# Altium schematic sheet 10scm153adp1_pwr.SchDoc
size A4; DocumentNumber: 3; SheetNumber: 3; SheetTotal: 3
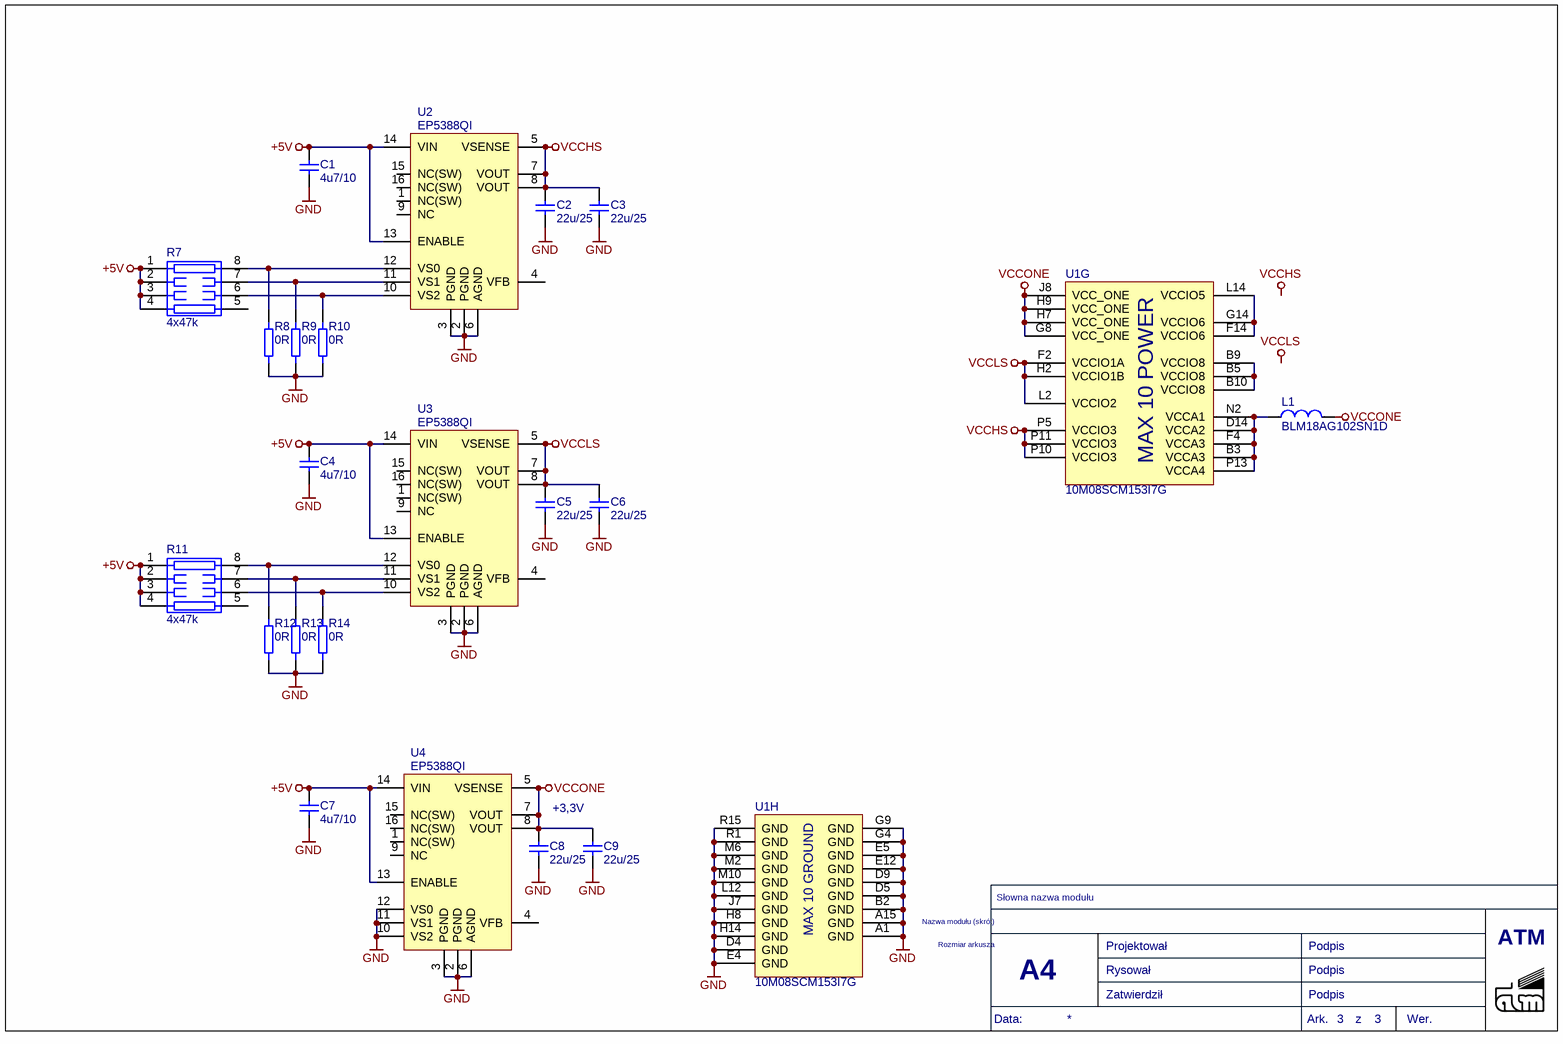
[diagram p0: 10scm153adp1_pwr.SchDoc]

## Parts
C1  4u7/10  [0603-IPC]
C2  22u/25  [0805]
C3  22u/25  [0805]
C4  4u7/10  [0603-IPC]
C5  22u/25  [0805]
C6  22u/25  [0805]
C7  4u7/10  [0603-IPC]
C8  22u/25  [0805]
C9  22u/25  [0805]
L1  BLM18AG102SN1D  [0603-IPC]
R7  4x47k  [1206RP]
R8  0R  [0603R]
R9  0R  [0603R]
R10  0R  [0603R]
R11  4x47k  [1206RP]
R12  0R  [0603R]
R13  0R  [0603R]
R14  0R  [0603R]
U1  10M08SCM153I7G  [MBGA153x15]  (parts G,H of 8)
U2  EP5388QI  [EP5368QI]
U3  EP5388QI  [EP5368QI]
U4  EP5388QI  [EP5368QI]

## Nets
+5V: C1.1 C4.1 C7.1 R7.1(R1) R7.2(R2) R7.3(R3) R7.4(R4) R11.1(R1) R11.2(R2) R11.3(R3) R11.4(R4) U2.13(ENABLE) U2.14(VIN) U3.13(ENABLE) U3.14(VIN) U4.13(ENABLE) U4.14(VIN)
GND: C1.2 C2.2 C3.2 C4.2 C5.2 C6.2 C7.2 C8.2 C9.2 R8.2 R9.2 R10.2 R12.2 R13.2 R14.2 U1.A1(GND) U1.A15(GND) U1.B2(GND) U1.D4(GND) U1.D5(GND) U1.D9(GND) U1.E4(GND) U1.E5(GND) U1.E12(GND) U1.G4(GND) U1.G9(GND) U1.H8(GND) U1.H14(GND) U1.J7(GND) U1.L12(GND) U1.M2(GND) U1.M6(GND) U1.M10(GND) U1.R1(GND) U1.R15(GND) U2.2(PGND) U2.3(PGND) U2.6(AGND) U3.2(PGND) U3.3(PGND) U3.6(AGND) U4.2(PGND) U4.3(PGND) U4.6(AGND) U4.10(VS2) U4.11(VS1) U4.12(VS0)
VCCHS: C2.1 C3.1 U1.P5(VCCIO3) U1.P10(VCCIO3) U1.P11(VCCIO3) U2.5(VSENSE) U2.7(VOUT) U2.8(VOUT)
VCCLS: C5.1 C6.1 U1.F2(VCCIO1A) U1.H2(VCCIO1B) U1.L2(VCCIO2) U3.5(VSENSE) U3.7(VOUT) U3.8(VOUT)
VCCONE: C8.1 C9.1 L1.2 U1.G8(VCC_ONE) U1.H7(VCC_ONE) U1.H9(VCC_ONE) U1.J8(VCC_ONE) U4.5(VSENSE) U4.7(VOUT) U4.8(VOUT)
NetL1_1: L1.1 U1.B3(VCCA3) U1.D14(VCCA2) U1.F4(VCCA3) U1.N2(VCCA1) U1.P13(VCCA4)
NetR7_6: R7.6(R6) R10.1 U2.10(VS2)
NetR7_7: R7.7(R7) R9.1 U2.11(VS1)
NetR7_8: R7.8(R8) R8.1 U2.12(VS0)
NetR11_6: R11.6(R6) R14.1 U3.10(VS2)
NetR11_7: R11.7(R7) R13.1 U3.11(VS1)
NetR11_8: R11.8(R8) R12.1 U3.12(VS0)
NetU1_B5: U1.B5(VCCIO8) U1.B9(VCCIO8) U1.B10(VCCIO8)
NetU1_F14: U1.F14(VCCIO6) U1.G14(VCCIO6) U1.L14(VCCIO5)

Not connected (* = marked no-connect by the designer): R7 5(R5); R11 5(R5); U2 1(NC(SW)) 4(VFB) 9(NC) 15(NC(SW)) 16(NC(SW)); U3 1(NC(SW)) 4(VFB) 9(NC) 15(NC(SW)) 16(NC(SW)); U4 1(NC(SW)) 4(VFB) 9(NC) 15(NC(SW)) 16(NC(SW))

## Notes on the sheet
- +3,3V
- Labels drawn without touching a wire or pin: VCCHS, VCCLS
- Nazwa modułu (skrót)
- Słowna nazwa modułu
- Rozmiar arkusza
- A4
- Zatwierdził
- Projektował
- Rysował
- Podpis
- ATM
- Data:
- Ark.
- z
- Wer.
- (in symbol ICs341, part G) MAX 10 POWER
- (in symbol ICs341, part H) MAX 10 GROUND

## Library data of the parts
C1 C4 C7 = CAP131: Kod: CAP131; ID: 131; Descript: Kondensator: ceramiczny; MLCC; 4,7uF; 10V; X5R; ±10%; SMD; 0603; Reference5: CL10A475KP8NNNC; Value: 4u7/10; Price5: 0; DateOfPrice5: 01-01-2010; Supplier5: tme.pl; Manufacturer5: Samsung; Typ5: CL10A475KP8NNNC
C2 C3 C5 C6 C8 C9 = CAP96: Kod: CAP96; ID: 96; Descript: Kondensator: ceramiczny; MLCC; 22uF; 25V; X5R; ±20%; SMD; 0805; Reference5: CL21A226MAQNNNE; Value: 22u/25; Price5: 1,5; DateOfPrice5: 29-12-2020; Supplier5: tme.pl; Manufacturer5: Samsung; Typ5: CL21A226MAQNNNE
L1 = Ind41: Kod: Ind41; ID: 41; Descript: Ferryt: koralik; Imp.@ 100MHz:1000om; Montaż: SMD; 0,4A; Obud:0603; Value: BLM18AG102SN1D; InductCurr: -; Price5: 0; DateOfPrice5: 10-05-2020; Supplier5: tme.pl; Reference5: BLM18AG102SN1D; Manufacturer5: Murata; Typ5: BLM18AG102SN1D
R7 R11 = Res182: Kod: Res182; ID: 182; Descript: Drabinka rezystorowa: Y; 47kΩ; SMD; 1206; Il.rezystorów:4; 63mW; Reference5: DR1206-47K-4/8; Typ5: 4D03WGJ0473T; Value: 4x47k; Price5: 0,1; DateOfPrice5: 10-05-2020; Supplier5: tme.pl; Manufacturer5: Royal Ohm
R8-R10 R12-R14 = Res1: Kod: Res1; ID: 1; Descript: Rezystor: thick film; SMD; 0603; 0ohm; 0,1W; ±5%; -55÷155°C; Reference5: RC0603JR-070R; Typ5: RC0603JR-070RL; Value: 0R; Price5: 0,1; DateOfPrice5: 25-06-2020; Supplier5: tme.pl; Manufacturer5: Yageo
U1 = ICs341: Kod: ICs341; ID: 341; Descript: FPGA - Field Programmable Gate Array non-volatile FPGA, 112 I/O, 153MBGA; Reference5: 989-10M08SCM153I7G; Value: 10M08SCM153I7G; Price5: 100; DateOfPrice5: 29-12-2020; Supplier5: Mouser; Manufacturer5: Intel; Typ5: 10M08SCM153I7G
U2-U4 = ICs340: Kod: ICs340; ID: 340; Descript: Switching Voltage Regulators 800mA BUCK REGULATOR INTEGRATED INDUCTOR; Reference5: 884-EP5388QI; Value: EP5388QI; Price5: 15; DateOfPrice5: 29-12-2020; Supplier5: Mouser; Manufacturer5: Intel; Typ5: EP5388QI